# Altium schematic sheet PCB_BLU1.SchDoc
size A4
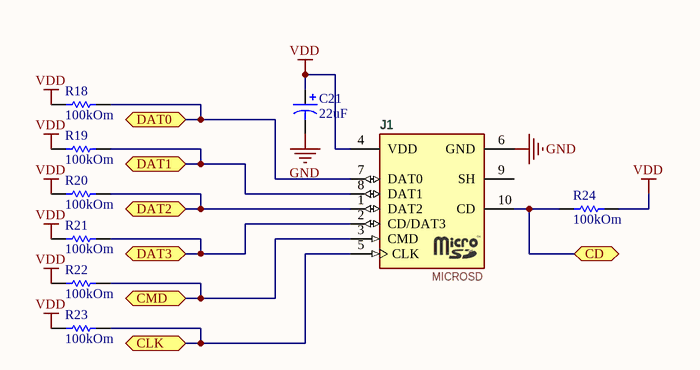
[diagram p0: PCB_BLU1.SchDoc]

## Parts
C21  22uF  [6032]
J1  MICROSD  [MICROSD]
R18  100kOm  [RES0201R]
R19  100kOm  [RES0201R]
R20  100kOm  [RES0201R]
R21  100kOm  [RES0201R]
R22  100kOm  [RES0201R]
R23  100kOm  [RES0201R]
R24  100kOm  [RES0201R]

## Ports
CD (bidir), CLK (bidir), CMD (bidir), DAT0 (bidir), DAT1 (bidir), DAT2 (bidir), DAT3 (bidir)

## Nets
GND: C21.2 J1.6(GND)
VDD: C21.1 J1.4(VDD) R18.2 R19.2 R20.2 R21.2 R22.2 R23.2 R24.1
CD: J1.10(CD) R24.2 ; port CD
CLK: J1.5(CLK) R23.1 ; port CLK
CMD: J1.3(CMD) R22.1 ; port CMD
DAT0: J1.7(DAT0) R18.1 ; port DAT0
DAT1: J1.8(DAT1) R19.1 ; port DAT1
DAT2: J1.1(DAT2) R20.1 ; port DAT2
DAT3: J1.2(CD/DAT3) R21.1 ; port DAT3

Not connected (* = marked no-connect by the designer): J1 9(SH)

## Library data of the parts
C21 = CWR11DH226M: Tantamount Military, Surface Mount MIL-PRF-55365/8 Qualified Solid Tantalum Chip Capacitor: 22uF, 20% Tolerance, 6 WVDC @ +85°C, Surge = 8V; Note: See Data Sheet for full range of components; Published: 19-Mar-2004; DatasheetDocument: 20-Mar-2003; PackageReference: 6032; Publisher: Altium Limited; Code_JEITA: 6032; ComponentLink1Description: Manufacturer Link; ComponentLink1URL: http://www.vishay.com/; ComponentLink2Description: Datasheet; ComponentLink2URL: http://www.vishay.com/docs/40011/cwr11.pdf; Value: 22uF
J1 = MICROSD: Memory Card Connectors Molex 504528-0892
R18-R24 = Resistor1: Resistor; Value: =Value